# EAGLE design Sch_v4 (EAGLE 9.6.2)
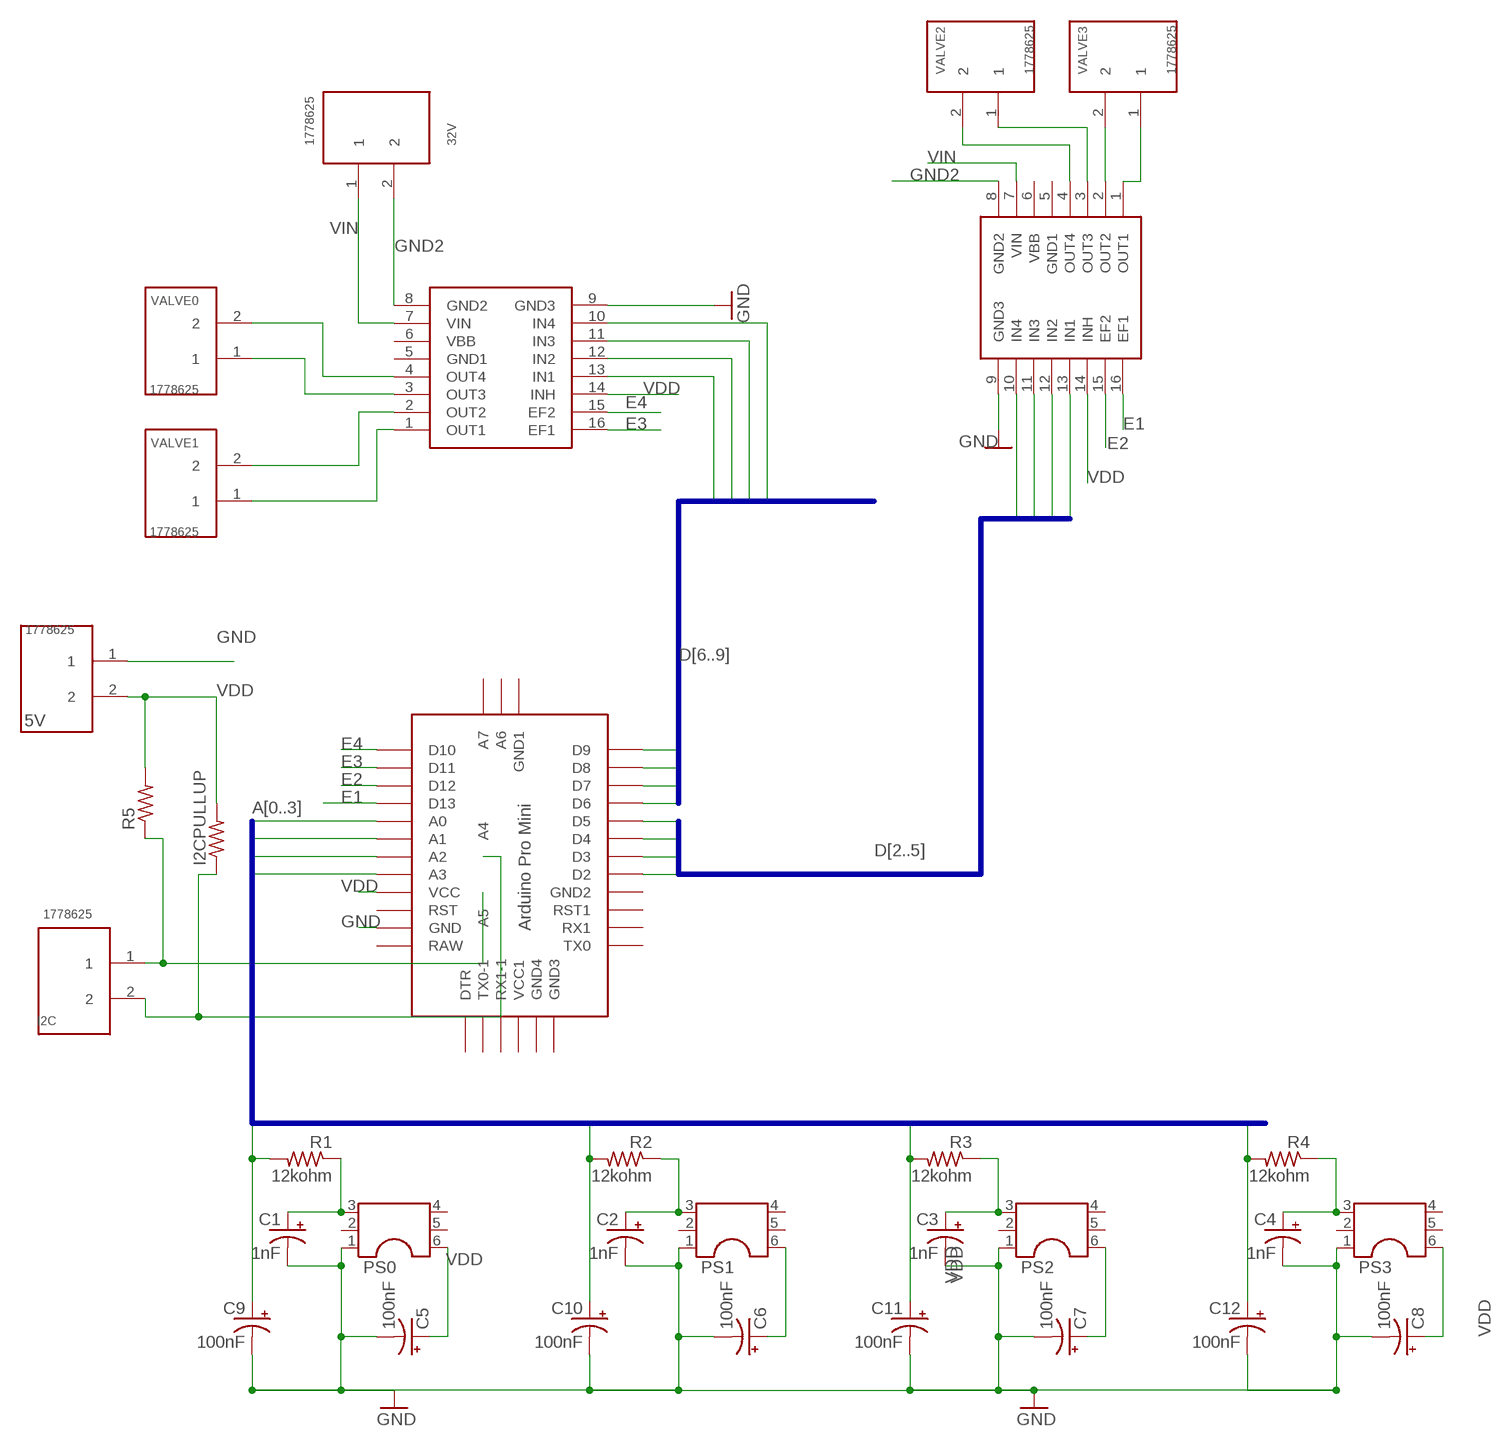
[diagram p0: schematic, sheet 1]

## Parts
5V  1778625  [1778625]
32V  1778625  [1778625]
C1  1nF  CPOL-USE2.5-5  [E2,5-5]
C2  1nF  CPOL-USE2.5-5  [E2,5-5]
C3  1nF  CPOL-USE2.5-5  [E2,5-5]
C4  1nF  CPOL-USE2.5-5  [E2,5-5]
C5  100nF  CPOL-USE2.5-5  [E2,5-5]
C6  100nF  CPOL-USE2.5-5  [E2,5-5]
C7  100nF  CPOL-USE2.5-5  [E2,5-5]
C8  100nF  CPOL-USE2.5-5  [E2,5-5]
C9  100nF  CPOL-USE2.5-5  [E2,5-5]
C10  100nF  CPOL-USE2.5-5  [E2,5-5]
C11  100nF  CPOL-USE2.5-5  [E2,5-5]
C12  100nF  CPOL-USE2.5-5  [E2,5-5]
I2C  1778625  [1778625]
I2CPULLUP  R-US_0204/7  [0204/7]
PS0  ABPDRNN100PGAA5  [ABPDRNN100PGAA5]
PS1  ABPDRNN100PGAA5  [ABPDRNN100PGAA5]
PS2  ABPDRNN100PGAA5  [ABPDRNN100PGAA5]
PS3  ABPDRNN100PGAA5  [ABPDRNN100PGAA5]
R1  12kohm  R-US_0204/7  [0204/7]
R2  12kohm  R-US_0204/7  [0204/7]
R3  12kohm  R-US_0204/7  [0204/7]
R4  12kohm  R-US_0204/7  [0204/7]
R5  R-US_0204/7  [0204/7]
U$1  ABK-PRO-MINI  [ABK-PRO-MINI]
U$2  A4990  [A4990]
U$3  A4990  [A4990]
VALVE0  1778625  [1778625]
VALVE1  1778625  [1778625]
VALVE2  1778625  [1778625]
VALVE3  1778625  [1778625]

## Nets
A0: C9.+ R1.2 U$1.A0
A1: C10.+ R2.2 U$1.A1
A2: C11.+ R3.2 U$1.A2
A3: C12.+ R4.2 U$1.A3
D2: U$1.D2 U$3.13(IN1)
D3: U$1.D3 U$3.12(IN2)
D4: U$1.D4 U$3.11(IN3)
D5: U$1.D5 U$3.10(IN4)
D6: U$1.D6 U$2.13(IN1)
D7: U$1.D7 U$2.12(IN2)
D8: U$1.D8 U$2.11(IN3)
D9: U$1.D9 U$2.10(IN4)
E1: U$1.D13 U$3.16(EF1)
E2: U$1.D12 U$3.15(EF2)
E3: U$1.D11 U$2.16(EF1)
E4: U$1.D10 U$2.15(EF2)
GND [GND]: 5V.1 C1.- C2.- C3.- C4.- C5.- C6.- C7.- C8.- C9.- C10.- C11.- C12.- PS0.1 PS1.1 PS2.1 PS3.1 U$1.GND U$2.9(GND3) U$3.9(GND3)
GND2: 32V.2 U$2.8(GND2) U$3.8(GND2)
N$1: C1.+ PS0.3 R1.1
N$2: C2.+ PS1.3 R2.1
N$3: C3.+ PS2.3 R3.1
N$4: C4.+ PS3.3 R4.1
N$5: U$2.2(OUT2) VALVE1.2
N$6: U$2.1(OUT1) VALVE1.1
N$7: U$2.3(OUT3) VALVE0.1
N$8: U$2.4(OUT4) VALVE0.2
N$13: U$3.1(OUT1) VALVE3.1
N$14: U$3.2(OUT2) VALVE3.2
N$15: U$3.3(OUT3) VALVE2.1
N$16: U$3.4(OUT4) VALVE2.2
N$21: I2C.1 R5.1 U$1.A5
VDD [Power]: 5V.2 C5.+ C6.+ C7.+ C8.+ I2C.2 I2CPULLUP.1 I2CPULLUP.2 PS0.6 PS1.6 PS2.6 PS3.6 R5.2 U$1.A4 U$1.VCC U$2.14(INH) U$3.14(INH)
VIN [Motor Power]: 32V.1 U$2.7(VIN) U$3.7(VIN)
Unconnected: PS0.2 PS0.4 PS0.5 PS1.2 PS1.4 PS1.5 PS2.2 PS2.4 PS2.5 PS3.2 PS3.4 PS3.5 U$1.A6 U$1.A7 U$1.DTR U$1.GND1(GND2) U$1.GND2(GND3) U$1.GND3(GND4) U$1.GND4(GND1) U$1.RAW U$1.RST U$1.RST1 U$1.RX1 U$1.RX1-1 U$1.TX0 U$1.TX0-1 U$1.VCC1 U$2.5(GND1) U$2.6(VBB) U$3.5(GND1) U$3.6(VBB)

## Buses
A[0..3]
D[2..5]
D[6..9]

## Notes on the sheet
- 5V

## Library data of the parts
5V 32V I2C VALVE0 VALVE1-VALVE3 = 1778625:1778625: 2 Position Terminal Block Header, Male Pins, Shrouded (4 Side) 0.098" (2.50mm) 90°, Right Angle Through Hole Check prices <https://pricing.snapeda.com/search/part/1778625/?ref=eda>; AVAILABILITY: Good; DESCRIPTION: 2 Position Terminal Block Header, Male Pins, Shrouded (4 Side) 0.098 (2.50mm) 90°, Right Angle Through Hole; MF: Phoenix Contact; MP: 1778625; PACKAGE: None; PRICE: None; PURCHASE-URL: https://pricing.snapeda.com/search/part/1778625/?ref=eda
C1-C12 = rcl:CPOL-US: POLARIZED CAPACITOR, American symbol; SPICEPREFIX: C
I2CPULLUP R1-R5 = rcl:R-US_: RESISTOR, American symbol; SPICEPREFIX: R
PS0 PS1-PS3 = RAD_2:ABPDRNN100PGAA5: Dual In Line / Socket
U$1 = Arduino-clone:ABK-PRO-MINI: ABK Pro-Mini Arduino Clone
U$2 U$3 = pololu-stepper-driver:A4990

## Net classes
1 Power: width 0.305 mm
3 Motor Power: width 0.305 mm, clearance 0.051 mm

## Board
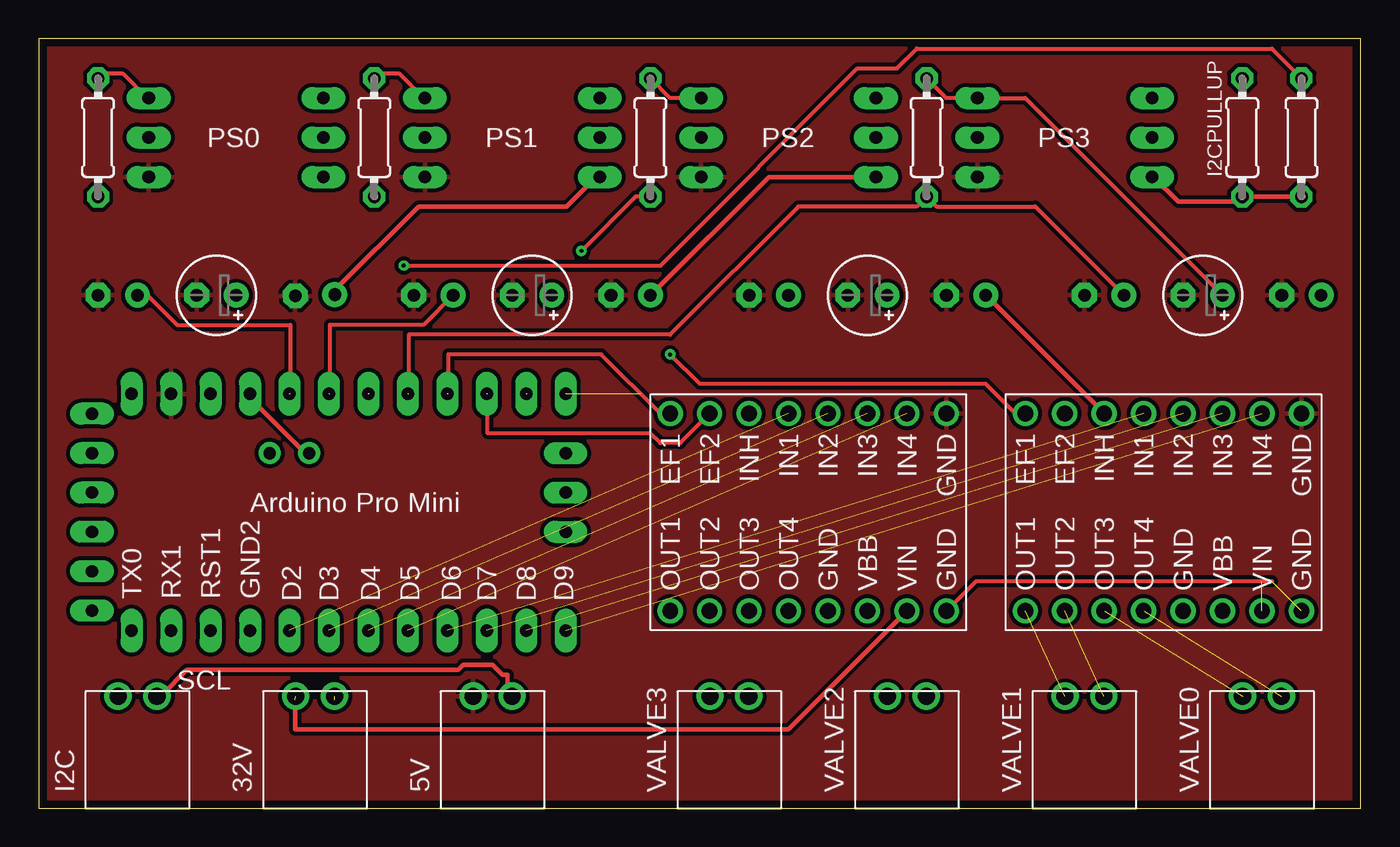
[diagram p1: board, top side]
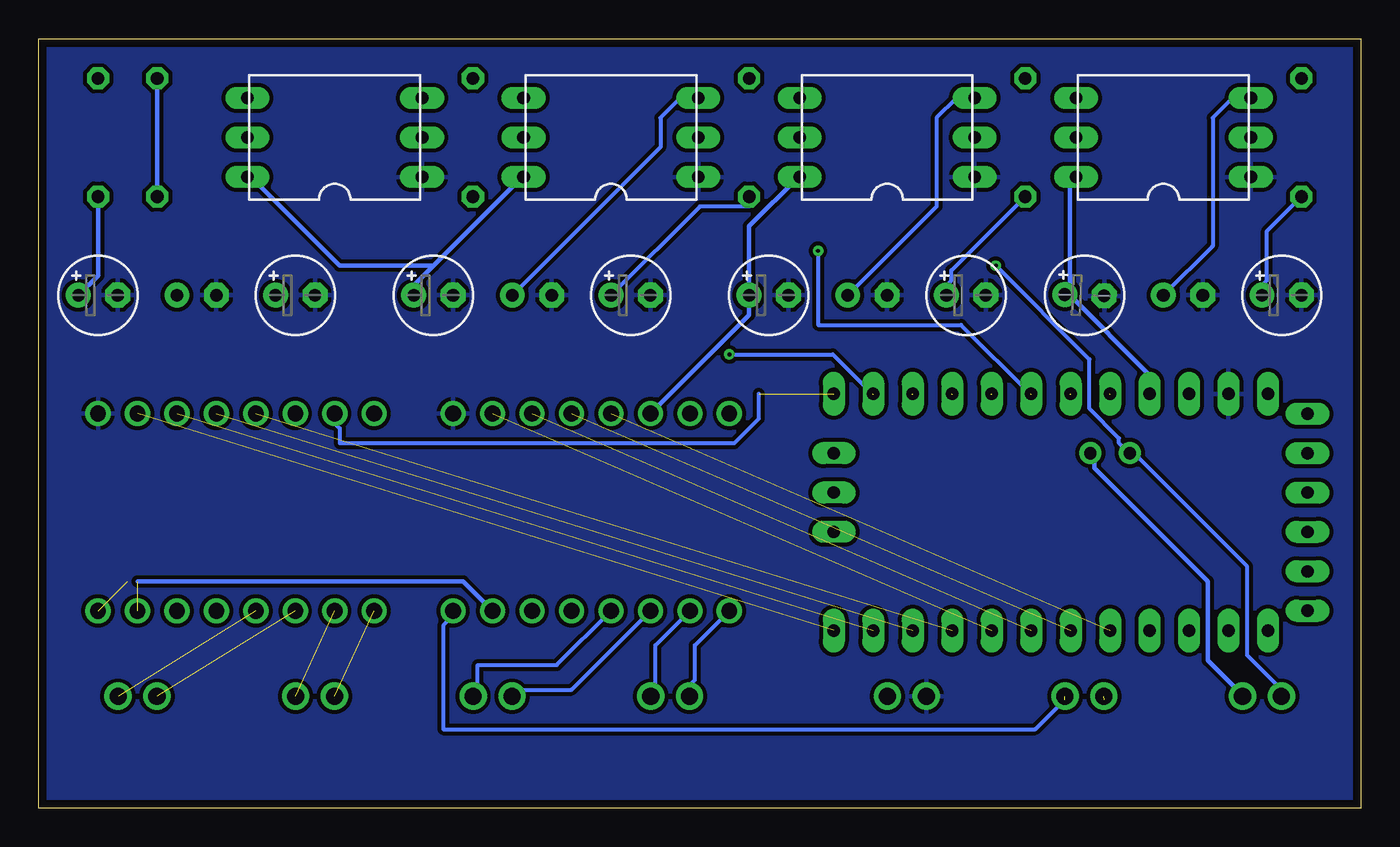
[diagram p2: board, bottom side, seen from below]

Size 85.09 x 49.53 mm. Coordinates in mm from the lower left corner, seen from the top.
Outline: 0,0 85.09,0 85.09,49.53 0,49.53 0,0
Copper layers (1*16): Top 0.035mm / dielectric 1.5mm / Bottom 0.035mm
Design rules "4pcb": minimum track width 10mil, minimum drill 10mil, track to track 10mil, track to pad 10mil, pad to pad 10mil, via to via 10mil, smd to smd 8mil, copper to edge 20mil, drill to drill 10mil, minimum pad ring 12mil, minimum via ring 8mil, stop-mask expansion 4mil, vias tented up to drill 0mil, thermal gap 10mil

### Footprints (pad centres in the part's own frame; a part is rotated, then mirrored left to right if it is on the bottom)
1778625 = drill 1.1: 1 -1.25,7.2; 2 1.25,7.2
E2,5-5 = drill 0.813 pad 1.6: + -1.27,0 | drill 0.813 pad 1.6 octagon: - 1.27,0
0204/7 = drill 0.813 octagon: 1 -3.81,0; 2 3.81,0
ABPDRNN100PGAA5 = drill 0.813 long: 1 -2.54,-5.625; 2 0,-5.625; 3 2.54,-5.625; 4 2.54,5.625; 5 0,5.625; 6 -2.54,5.625
ABK-PRO-MINI = drill 0.8 long: A0 10.16,-3.81; A1 10.16,-6.35; A2 10.16,-8.89; A3 10.16,-11.43; A6 3.81,-21.59; A7 6.35,-21.59; D2 -5.08,-3.81; D3 -5.08,-6.35; D4 -5.08,-8.89; D5 -5.08,-11.43; D6 -5.08,-13.97; D7 -5.08,-16.51; D8 -5.08,-19.05; D9 -5.08,-21.59; D10 10.16,-21.59; D11 10.16,-19.05; D12 10.16,-16.51; D13 10.16,-13.97; DTR 8.89,8.89; GND 10.16,3.81; GND1 -5.08,-1.27; GND2 -3.81,8.89; GND3 -1.27,8.89; GND4 1.27,-21.59; RAW 10.16,6.35; RST 10.16,1.27; RST1 -5.08,1.27; RX1 -5.08,3.81; RX1-1 3.81,8.89; TX0 -5.08,6.35; TX0-1 6.35,8.89; VCC 10.16,-1.27; VCC1 1.27,8.89 | drill 0.8: A4 6.35,-5.08; A5 6.35,-2.54
A4990 = drill 1.016: 1 -6.35,8.89; 2 -6.35,6.35; 3 -6.35,3.81; 4 -6.35,1.27; 5 -6.35,-1.27; 6 -6.35,-3.81; 7 -6.35,-6.35; 8 -6.35,-8.89; 9 6.35,-8.89; 10 6.35,-6.35; 11 6.35,-3.81; 12 6.35,-1.27; 13 6.35,1.27; 14 6.35,3.81; 15 6.35,6.35; 16 6.35,8.89

### Placement (x,y rotation side)
5V  29.21,0 0 top
32V  17.78,0 0 top
C1  11.43,33.02 180 top
C2  31.75,33.02 180 top
C3  53.34,33.02 180 top
C4  74.93,33.02 180 top
C5  17.78,33.02 358.1 bottom
C6  38.1,33.02 0 bottom
C7  59.69,33.02 0 bottom
C8  81.28,33.02 0 bottom
C9  5.08,33.02 0 bottom
C10  25.4,33.02 0 bottom
C11  46.99,33.02 0 bottom
C12  68.58,33.02 0 bottom
I2C  6.35,0 0 top
I2CPULLUP  77.47,43.18 90 top
PS0  12.7,43.18 90 bottom
PS1  30.48,43.18 90 bottom
PS2  48.26,43.18 90 bottom
PS3  66.04,43.18 90 bottom
R1  3.81,43.18 270 top
R2  21.59,43.18 270 top
R3  39.37,43.18 270 top
R4  57.15,43.18 270 top
R5  81.28,43.18 270 top
U$1  12.32,16.51 90 top
U$2  72.39,19.05 90 top
U$3  49.53,19.05 90 top
VALVE0  78.74,0 0 top
VALVE1  67.31,0 0 top
VALVE2  55.88,0 0 top
VALVE3  44.45,0 0 top

### Tracks (layer width: path | path; a pad name or v marks a point on that pad's centre or on a via)
A0  (1 unrouted)
  Top 0.254: 16.19,26.67 16.19,31.12 8.89,31.12 6.98,33.02 C9.+
  Bottom 0.254: R1.2 6.03,37.15 6.03,33.97 6.35,33.66 C9.+
A1  (1 unrouted)
  Top 0.254: 18.73,26.67 18.73,31.12 24.77,31.12 C10.+
  Bottom 0.254: R2.2 26.35,34.61 26.35,33.97 26.67,33.66 C10.+
A2  (via drill 0.25)  (1 unrouted)
  Top 0.254: v34.92,35.88 38.42,39.37 R3.2
  Bottom 0.254: 21.27,26.67 25.72,31.12 34.92,31.12 v34.92,35.88 | C11.+ 42.55,38.73 39.37,38.73 R3.2
A3  (1 unrouted)
  Top 0.254: 23.81,26.67 23.81,30.48 40.64,30.48 48.89,38.73 56.52,38.73 R4.2 57.78,38.73 64.14,38.73 C12.+
D2  (1 unrouted)
D3  (1 unrouted)
D4  (1 unrouted)
D5  (1 unrouted)
D6  (1 unrouted)
D7  (1 unrouted)
D8  (1 unrouted)
D9  (1 unrouted)
E1  (1 unrouted)
  Top 0.254: 26.35,26.67 26.35,29.21 36.2,29.21 40,25.4 U$3.16
E2  (1 unrouted)
  Top 0.254: 28.89,26.67 28.89,24.13 39.37,24.13 40,23.5 41.27,23.5 U$3.15
E3  (via drill 0.25)  (1 unrouted)
  Top 0.254: v40.64,29.21 42.55,27.31 60.96,27.31 62.86,25.4 U$2.16
  Bottom 0.254: 31.43,26.67 33.97,29.21 v40.64,29.21
E4  (1 unrouted)
  Bottom 0.254: 38.73,26.67 38.73,25.08 40.32,23.5 65.72,23.5 65.72,24.45 66.04,24.77 U$2.15
GND
  pour Top: 0,0 85.09,0 85.09,49.53 0,49.53
  pour Bottom: 0,49.53 0,0 85.09,0 85.09,49.53
GND2  (2 unrouted)
  Top 0.254: U$3.8 60.33,14.61 79.38,14.61
  Bottom 0.254: 19.05,6.98 20.95,5.08 59.05,5.08 59.05,11.75 58.42,12.38 U$3.8
N$1
  Top 0.254: R1.1 4.13,47.31 5.4,47.31 6.98,45.72 PS0.3
  Bottom 0.254: C1.+ 9.52,36.2 9.52,44.45 8.25,45.72 PS0.3
N$2
  Top 0.254: R2.1 21.91,47.31 23.18,47.31 24.77,45.72 PS1.3
  Bottom 0.254: C2.+ 27.3,38.73 27.3,44.45 26.04,45.72 PS1.3
N$3
  Top 0.254: R3.1 40.64,45.72 PS2.3
  Bottom 0.254: C3.+ 45.08,42.55 45.08,44.45 43.81,45.72 PS2.3
N$4
  Top 0.254: R4.1 58.42,45.72 PS3.3 63.5,45.72 C4.+
N$5  (1 unrouted)
N$6  (1 unrouted)
N$7  (1 unrouted)
N$8  (1 unrouted)
N$13
  Bottom 0.254: U$3.1 42.86,10.48 42.86,8.26 43.18,7.94 43.18,7.3 VALVE3.1
N$14
  Bottom 0.254: U$3.2 45.4,10.48 45.4,7.3 VALVE3.2
N$15
  Bottom 0.254: U$3.3 50.8,7.62 54.61,7.62 54.61,7.3 VALVE2.1
N$16
  Bottom 0.254: U$3.4 51.75,9.21 56.83,9.21 56.83,7.3 VALVE2.2
N$21  (via drill 0.25)
  Top 0.254: R5.1 79.38,48.9 56.52,48.9 55.24,47.62 52.7,47.62 40,34.93 v23.49,34.93
  Bottom 0.254: I2C.1 5.4,7.3 5.4,7.94 7.3,9.84 7.3,15.56 14.6,22.86 U$1.A5 14.92,22.86 15.56,23.5 15.56,23.81 17.46,25.72 17.46,28.89 v23.49,34.93
VDD
  Top 0.305: U$1.A4 17.14,22.86 13.33,26.67 U$1.VCC | 5V.2 30.16,7.3 30.16,8.57 29.84,8.57 29.21,9.21 27.3,9.21 26.99,8.89 9.52,8.89 7.94,7.3 7.62,7.3 I2C.2 | R5.2 I2CPULLUP.1 77.15,39.05 73.34,39.05 71.75,40.64 PS3.6 | C7.+ U$2.14 | C6.+ 46.99,40.64 PS2.6 | C5.+ 19.05,33.34 24.45,38.73 33.97,38.73 35.88,40.64 PS1.6
  Bottom 0.305: PS0.6 18.41,40.64 18.73,40.32 18.73,33.34 C5.+ 18.73,33.02 13.65,27.94 13.65,26.67 U$1.VCC | I2C.2 7.62,7.3 9.84,9.52 9.84,14.61 17.14,21.91 17.14,22.86 U$1.A4 | PS1.6 36.2,40.64 39.37,37.47 C6.+ 39.37,31.75 U$3.14 | I2CPULLUP.1 I2CPULLUP.2 | C8.+ 81.28,34.29 R5.2 | 59.69,34.93 60.96,33.66 C7.+ | 59.69,34.93 53.97,40.64 PS2.6 | 59.69,34.93 65.72,34.93 71.44,40.64 PS3.6
VIN  (2 unrouted)
  Top 0.305: 16.51,6.98 16.51,5.08 48.26,5.08 U$3.7
  Bottom 0.305: U$3.7 57.78,14.61 78.74,14.61

### Text on the board
tPlace: Arduino Pro Mini | D2 | D3 | D4 | D5 | D6 | D7 | D8 | D9 | TX0 | RX1 | RST1 | GND2 | SCL